# EAGLE schematic SerialTrainSensor (EAGLE 6.1)
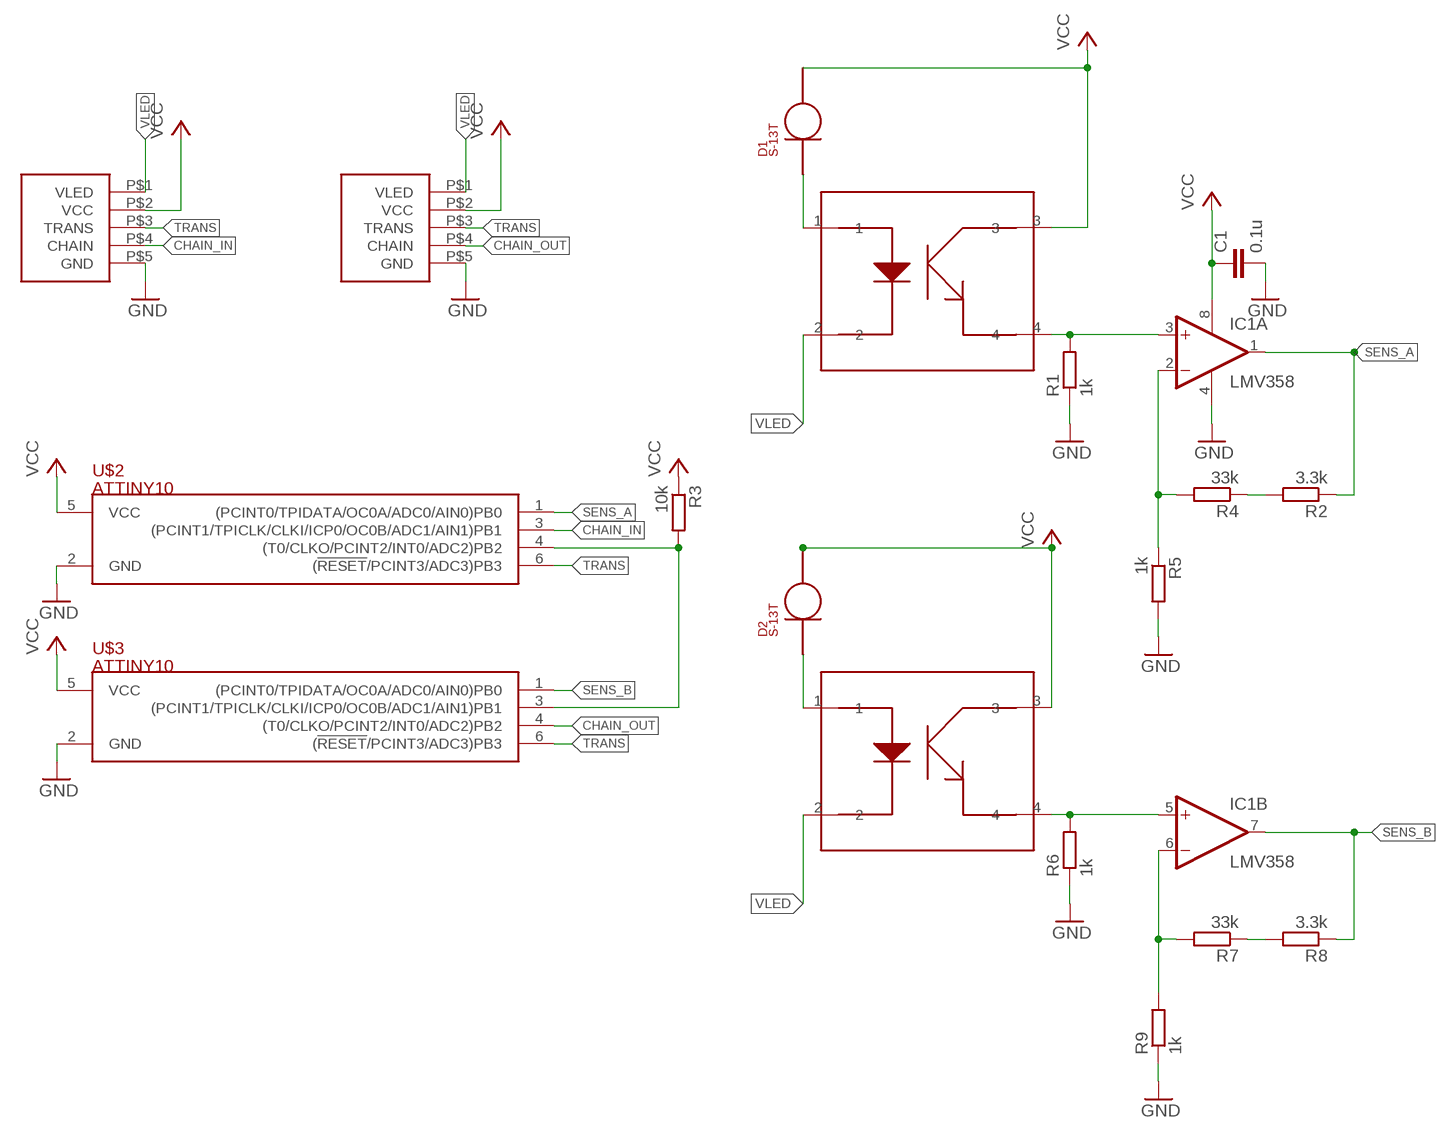
[diagram p0: schematic, sheet 1]

## Parts
C1  0.1u  C-EUC0603  [C0603]
D1  S-13T  [S-1*3T]
D2  S-13T  [S-1*3T]
IC1  LMV358  [TSSOP8]
R1  1k  R-EU_R0603  [R0603]
R2  3.3k  R-EU_R0603  [R0603]
R3  10k  R-EU_R0603  [R0603]
R4  33k  R-EU_R0603  [R0603]
R5  1k  R-EU_R0603  [R0603]
R6  1k  R-EU_R0603  [R0603]
R7  33k  R-EU_R0603  [R0603]
R8  3.3k  R-EU_R0603  [R0603]
R9  1k  R-EU_R0603  [R0603]
SMD1  SERIAL_SENSORHALF  [SERIAL_5_HALF]
SMD2  SERIAL_SENSORHALF  [SERIAL_5_HALF]
U$1  TPR-105F  [TPR-105F]
U$2  ATTINY10  [SOT-23]
U$3  ATTINY10  [SOT-23]
U$4  TPR-105F  [TPR-105F]

## Nets
CHAIN_IN: SMD1.P$4(CHAIN) U$2.3((PCINT1/TPICLK/CLKI/ICP0/OC0B/ADC1/AIN1)PB1)
CHAIN_OUT: SMD2.P$4(CHAIN) U$3.4((T0/CLKO/PCINT2/INT0/ADC2)PB2)
GND: C1.2 IC1.4(P:V-) R1.1 R5.2 R6.1 R9.1 SMD1.P$5(GND) SMD2.P$5(GND) U$2.2(GND) U$3.2(GND)
N$1: D1.C U$1.1
N$2: IC1.3(A:+IN) R1.2 U$1.4
N$3: D2.C U$4.1
N$4: R3.2 U$2.4((T0/CLKO/PCINT2/INT0/ADC2)PB2) U$3.3((PCINT1/TPICLK/CLKI/ICP0/OC0B/ADC1/AIN1)PB1)
N$5: IC1.5(B:+IN) R6.2 U$4.4
N$6: IC1.2(A:-IN) R4.2 R5.1
N$7: IC1.6(B:-IN) R7.2 R9.2
N$8: R2.2 R4.1
N$9: R7.1 R8.2
SENS_A: IC1.1(A:OUT) R2.1 U$2.1((PCINT0/TPIDATA/OC0A/ADC0/AIN0)PB0)
SENS_B: IC1.7(B:OUT) R8.1 U$3.1((PCINT0/TPIDATA/OC0A/ADC0/AIN0)PB0)
TRANS: SMD1.P$3(TRANS) SMD2.P$3(TRANS) U$2.6((!RESET!/PCINT3/ADC3)PB3) U$3.6((!RESET!/PCINT3/ADC3)PB3)
VCC [vcc]: C1.1 D1.A D2.A IC1.8(P:V+) R3.1 SMD1.P$2(VCC) SMD2.P$2(VCC) U$1.3 U$2.5(VCC) U$3.5(VCC) U$4.3
VLED [led]: SMD1.P$1(VLED) SMD2.P$1(VLED) U$1.2 U$4.2

## Library data of the parts
C1 = rcl:C-EU: CAPACITOR, European symbol
D1 D2 = myparts:S-1*3T
IC1 = myparts:LMV358?*: Dual General Purpose, Low Voltage, Rail-to-Rail Output Operational Amplifiers Source: http://www.national.com/mpf/LM/LMV321.html http://www.national.com/dt/lmv_qual.pdf
R1-R9 = rcl:R-EU_: RESISTOR, European symbol
SMD1 SMD2 = myparts:SERIAL_SENSOR
U$1 U$4 = myparts:TPR-105F
U$2 U$3 = myparts:ATTINY10

## Net classes
1 led: width 0.381 mm
2 vcc: width 0.254 mm